# EasyEDA Pro project ProProject_AT32F403A拓展版_2024-07-07.epro

# Schematic Schematic1
Create Date: 2024-06-26; Page Name: P1; Project Name: AT32F403A拓展版; Schematic Name: Schematic1; Update Date: 2024-06-26; Company: 嘉立创EDA; Page Size: A4; Version: V1.0
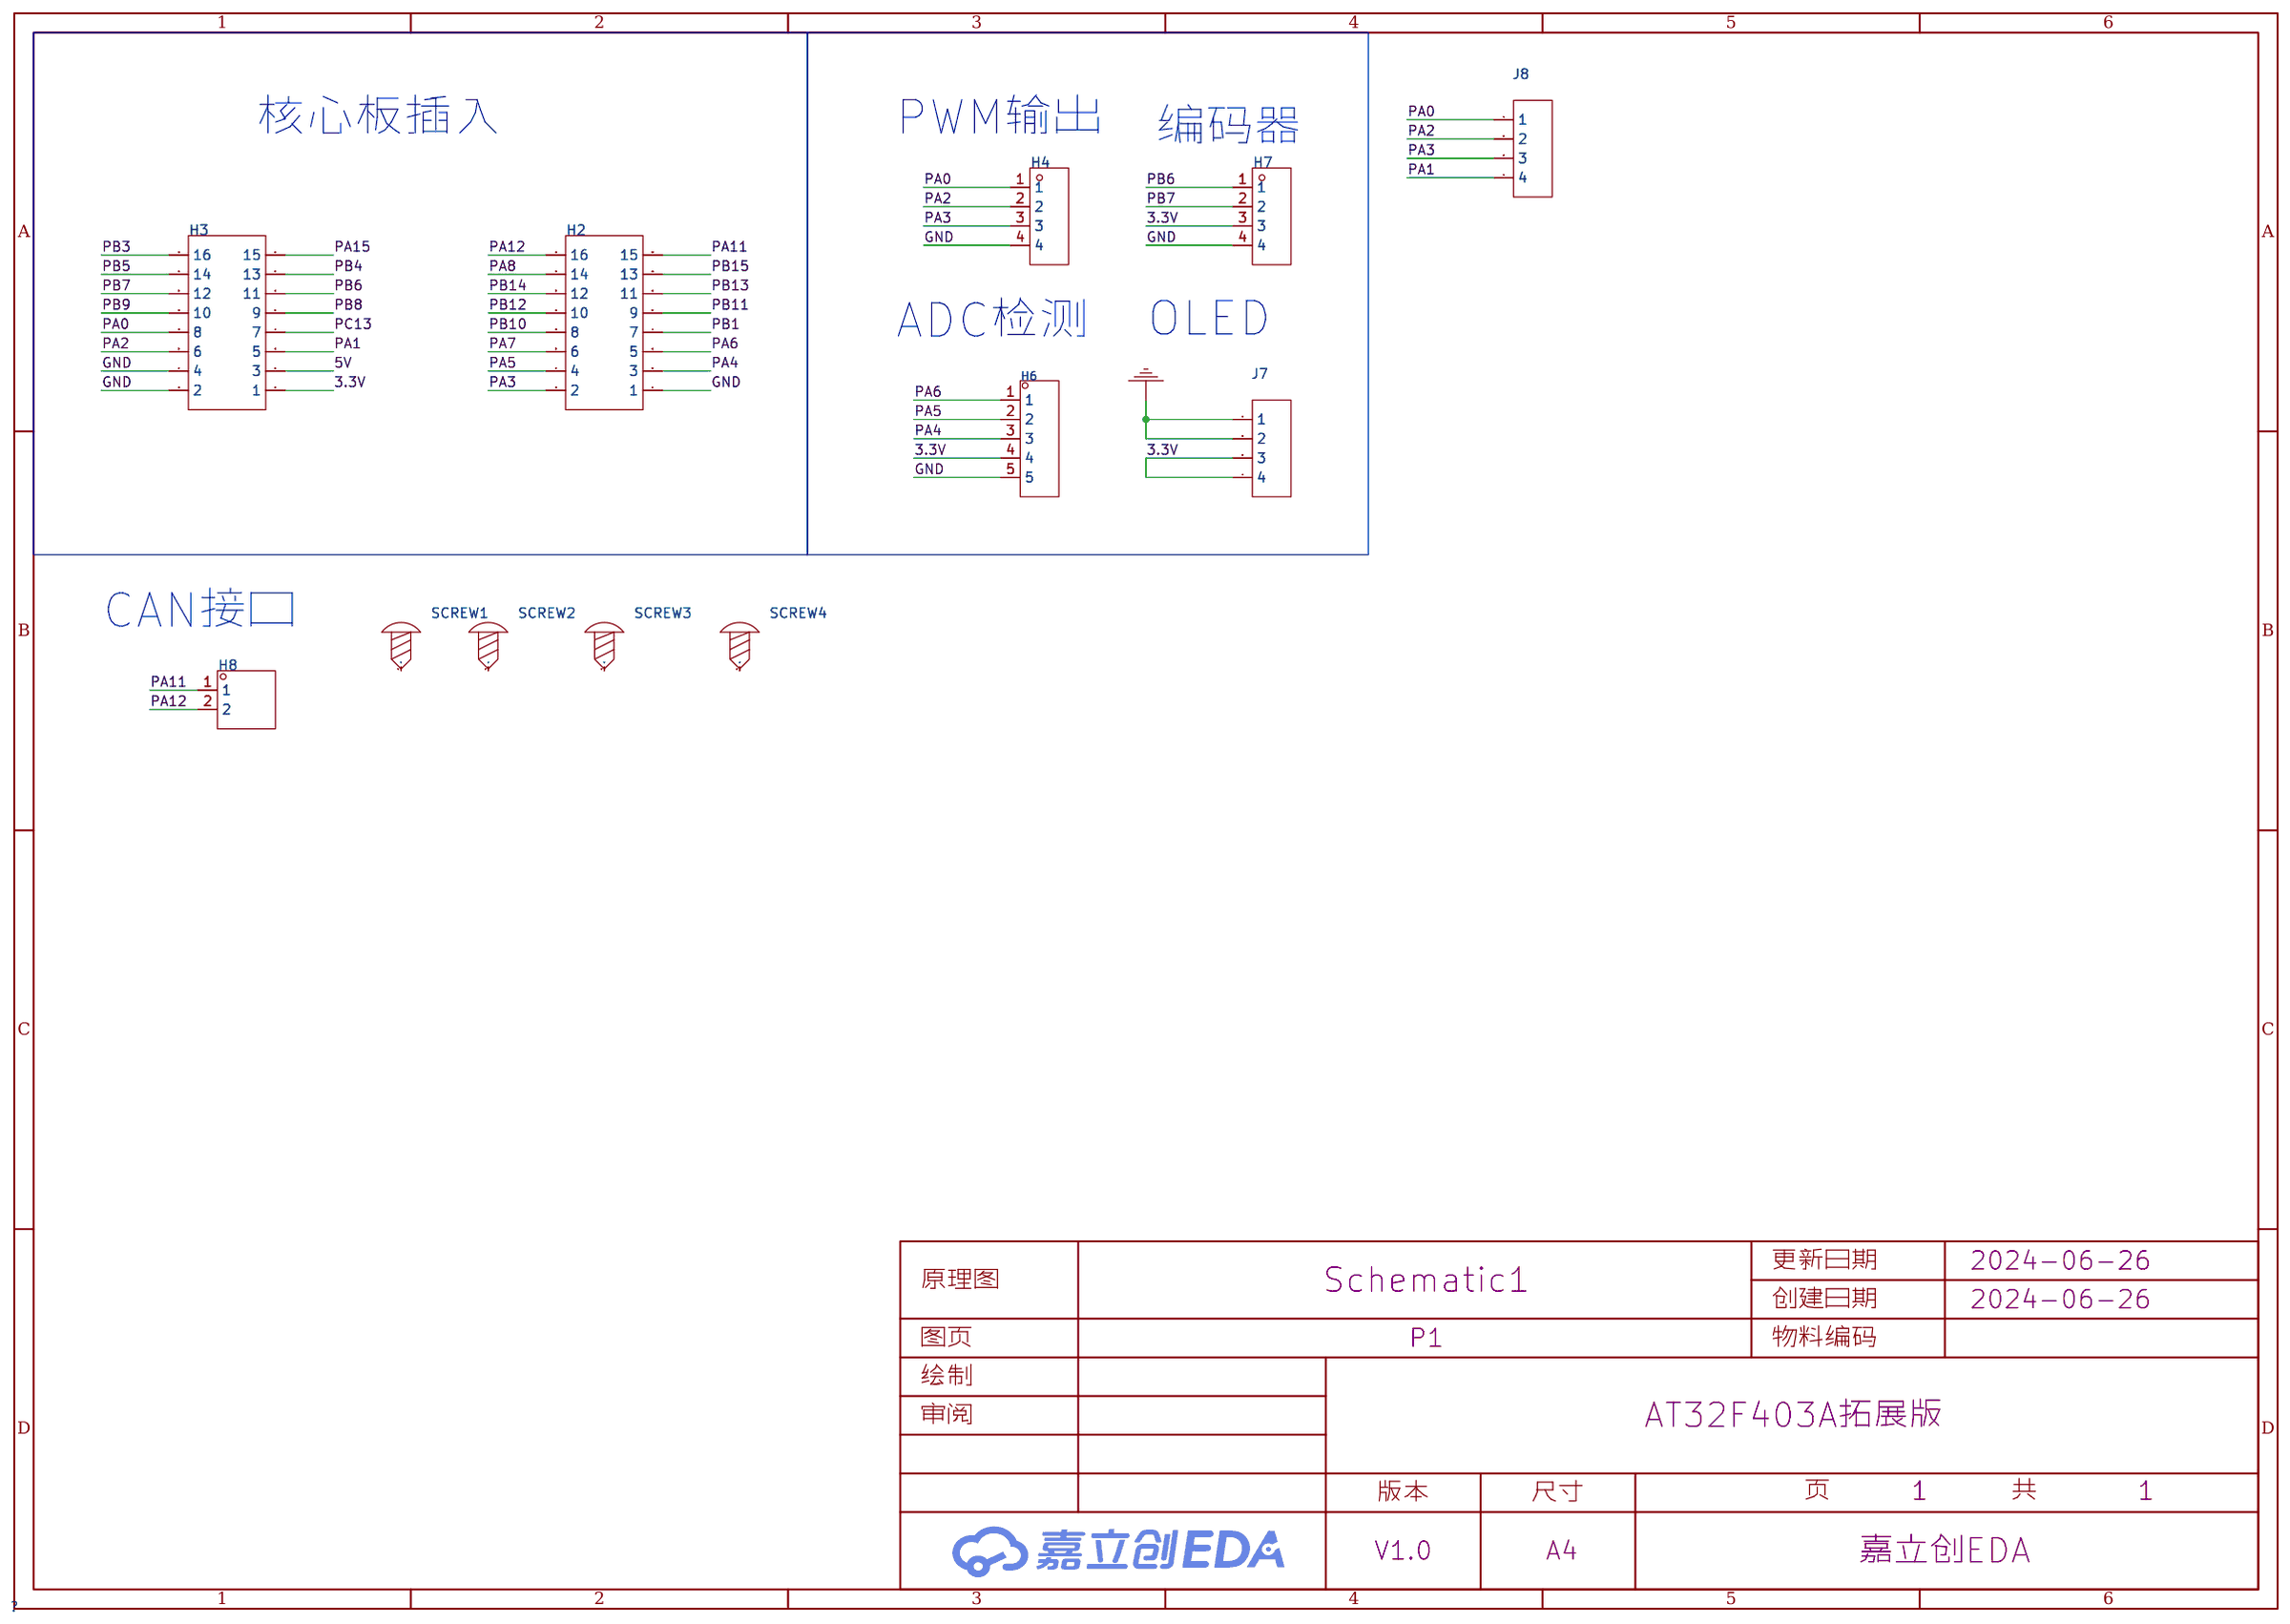
[diagram p0: schematic sheet]

## Parts
H2  -  [HDR-TH_16P-P2.54-V-M-R2-C8-S2.54]
H3  -  [HDR-TH_16P-P2.54-V-M-R2-C8-S2.54]
H4  -  [HDR-TH_4P-P2.54-V-M]
H6  -  [HDR-TH_5P-P2.54-V-M]
H7  -  [HDR-TH_4P-P2.54-V-M]
H8  -  [HDR-TH_2P-P2.54-V-M-1]
J7  HDR-M-2.54_1x4  [footprint_c5e7]
J8  HDR-M-2.54_1x4  [footprint_c5e7]
SCREW1  -  [M2螺丝]
SCREW2  -  [M2螺丝]
SCREW3  -  [M2螺丝]
SCREW4  -  [M2螺丝]

## Library data of the parts
H2 H3 = HDR-M_2.54_2x8: Supplier Part: C68234; Supplier Footprint: 插件,P=2.54mm
H4 H7 = HDR-M_2.54_1x4P: Supplier Part: C492403; Supplier Footprint: 插件
H6 = HDR-M_2.54_1x5P: Supplier Part: C358687; Supplier Footprint: 插件
H8 = HDR-M_2.54_1x2P: Supplier Part: C124375; Supplier Footprint: 插件
J7 J8 = HDR-M-2.54_1x4: Supplier Part: C124378; Supplier: LCSC
SCREW1-SCREW4 = M2螺丝: Supplier Footprint: 插件

## Nets
3.3V: H3.1 H6.4 H7.3 J7.3 J7.4
5V: H3.3
GND: H2.1 H3.2 H3.4 H4.4 H6.5 H7.4 J7.1 J7.2
PA0: H3.8 H4.1 J8.1
PA1: H3.5 J8.4
PA2: H3.6 H4.2 J8.2
PA3: H2.2 H4.3 J8.3
PA4: H2.3 H6.3
PA5: H2.4 H6.2
PA6: H2.5 H6.1
PA7: H2.6
PA8: H2.14
PA11: H2.15 H8.1
PA12: H2.16 H8.2
PA15: H3.15
PB1: H2.7
PB3: H3.16
PB4: H3.13
PB5: H3.14
PB6: H3.11 H7.1
PB7: H3.12 H7.2
PB8: H3.9
PB9: H3.10
PB10: H2.8
PB11: H2.9
PB12: H2.10
PB13: H2.11
PB14: H2.12
PB15: H2.13
PC13: H3.7

Not connected (* = marked no-connect by the designer): SCREW1 1; SCREW2 1; SCREW3 1; SCREW4 1

## Notes on the sheet
- 核心板插入
- PWM输出
- 编码器
- ADC检测
- OLED
- CAN接口

# Board PCB1
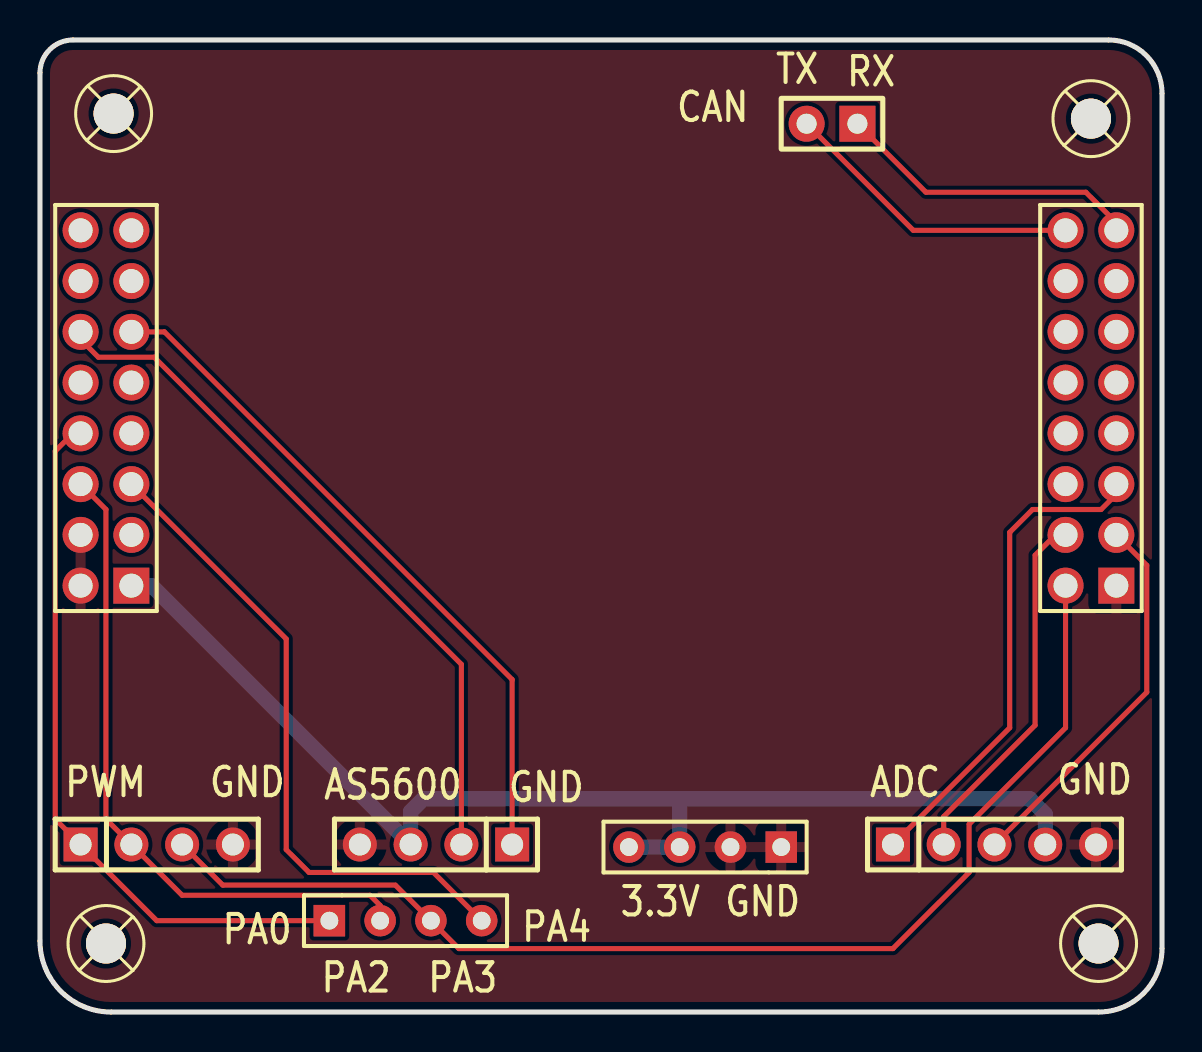
[diagram p1: board, top side]
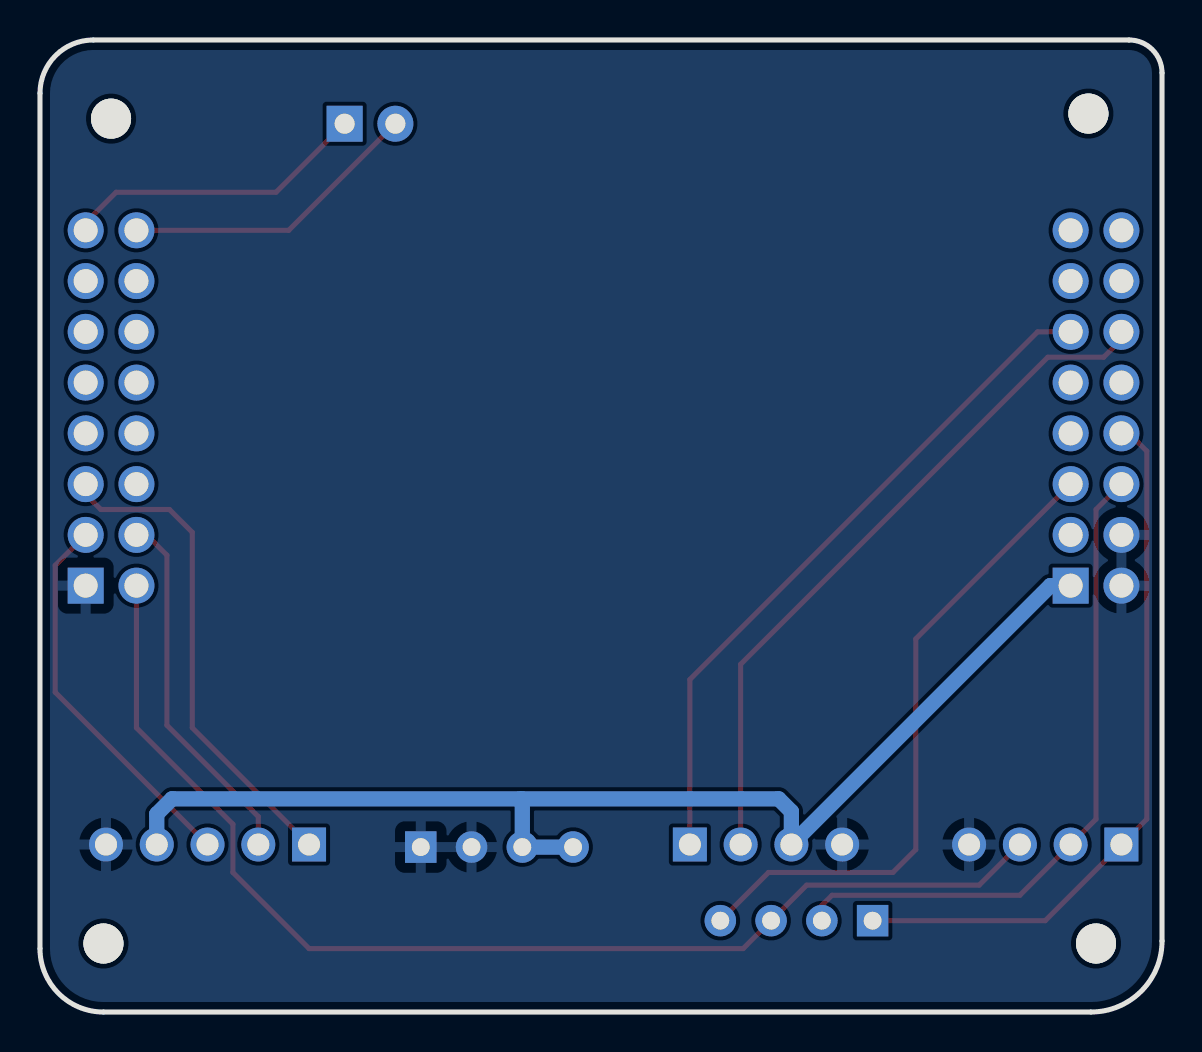
[diagram p2: board, bottom side, seen from below]

Outline 56.13 x 48.64 mm; copper layers: Top Layer, Bottom Layer. Coordinates in mm from the lower left corner of the outline.
Outline path: 0,46.99 arc(0.48,48.16) 1.65,48.64 53.47,48.64 arc(55.35,47.86) 56.13,45.97 56.13,3.17 arc(55.2,0.93) 52.96,0 3.56,0 arc(1.04,1.04) 0,3.56 0,46.99
Stack: Top Layer 0.035mm / Dielectric1 1.51mm FR4 er 4.5 / Bottom Layer 0.035mm

## Design rules (mm)
template: JLCPCB Capability(Two Layers Board)
spacing copperThickness1oz (default): track to track 0.102, other pairs 0.152 to 0.3
spacing copperThickness2oz: track to track 0.203, other pairs 0.152 to 0.3
track width copperThickness1oz (default): min 0.127, default 0.254, max 2.54
track width copperThickness2oz: min 0.203, default 0.254, max 2.54
differential pair differentialPair (default): width min 0.127, default 0.254, max 2.54; gap min 0.152, default 0.152
via viaSize (default): diameter min 0.5, default 0.61, max 10; hole min 0.3, default 0.305, max 6.3

## Placement (name value [footprint] x y rotation side)
H2  -  [HDR-TH_16P-P2.54-V-M-R2-C8-S2.54]  52.58 30.23 90 top
H3  -  [HDR-TH_16P-P2.54-V-M-R2-C8-S2.54]  3.3 30.23 90 top
H4  -  [HDR-TH_4P-P2.54-V-M]  5.84 8.38 0 top
H6  -  [HDR-TH_5P-P2.54-V-M]  47.75 8.38 0 top
H7  -  [HDR-TH_4P-P2.54-V-M]  19.81 8.38 180 top
H8  -  [HDR-TH_2P-P2.54-V-M-1]  39.62 44.45 180 top
J7  HDR-M-2.54_1x4  [footprint_c5e7]  33.27 8.25 180 top
J8  HDR-M-2.54_1x4  [footprint_c5e7]  18.29 4.57 0 top
SCREW1  -  [M2螺丝]  3.68 44.96 0 top
SCREW2  -  [M2螺丝]  52.58 44.7 0 top
SCREW3  -  [M2螺丝]  3.3 3.43 0 top
SCREW4  -  [M2螺丝]  52.96 3.43 0 top

## Footprints (pads in the part's own frame, mm; a bottom-side part is the same pattern mirrored in y, then rotated)
footprint_c5e7
  rect 1.575x1.575 hole 0.889: 1(-3.81,0)
  round 1.575 hole 0.889: 2(-1.27,0) 3(1.27,0) 4(3.81,0)
HDR-TH_2P-P2.54-V-M-1
  rect 1.8x1.8 hole 1: 1(-1.27,0)
  round 1.8 hole 1: 2(1.27,0)
HDR-TH_4P-P2.54-V-M
  rect 1.7x1.7 hole 1.1: 1(-3.81,0)
  round 1.7 hole 1.1: 2(-1.27,0) 3(1.27,0) 4(3.81,0)
HDR-TH_5P-P2.54-V-M
  rect 1.7x1.7 hole 1.1: 1(-5.08,0)
  round 1.7 hole 1.1: 2(-2.54,0) 3(0,0) 4(2.54,0) 5(5.08,0)
HDR-TH_16P-P2.54-V-M-R2-C8-S2.54
  rect 1.8x1.8 hole 1.2: 1(-8.89,-1.27)
  round 1.8 hole 1.2: 2(-8.89,1.27) 3(-6.35,-1.27) 4(-6.35,1.27) 5(-3.81,-1.27) 6(-3.81,1.27) 7(-1.27,-1.27) 8(-1.27,1.27) 9(1.27,-1.27) 10(1.27,1.27) 11(3.81,-1.27) 12(3.81,1.27) 13(6.35,-1.27) 14(6.35,1.27) 15(8.89,-1.27) 16(8.89,1.27)
M2螺丝
  round 2 hole 2: 1(0,0)

## Nets
As in the schematic.

Pads without a net: SCREW1 1; SCREW2 1; SCREW3 1; SCREW4 1

## Routing (per net, layer and track width the routed paths; a pad name or vN(x,y) marks a point on that pad's centre or on a via; arc(x,y) is an arc through that point)
3.3V: length 59.8
  Bottom Layer w0.762: 32.07,10.67 49.53,10.67 50.29,9.91 H6.4 ; 32.07,10.67 19.18,10.67 18.54,10.03 H7.3 5.59,21.34 H3.1 ; 32.07,10.67 32,10.61 32,8.25 J7.4
PA0: length 35.9
  Top Layer w0.254: J8.1 5.84,4.57 H4.1 0.76,9.65 0.76,28.07 1.65,28.96 H3.8
PA1: length 32.7
  Top Layer w0.254: J8.4 19.68,6.98 13.46,6.98 12.32,8.13 12.32,18.67 H3.5
PA2: length 33.2
  Top Layer w0.254: J8.2 17.02,5.33 16.51,5.84 7.11,5.84 4.82,8.13 ; H3.6 3.3,25.15 3.3,9.65 H4.2
PA3: length 59.1
  Top Layer w0.254: 7.36,8.13 9.14,6.35 17.78,6.35 J8.3 20.95,3.17 42.67,3.17 46.48,6.98 46.48,9.4 51.31,14.22 51.31,21.34
PA4: length 19.3
  Top Layer w0.254: H2.3 55.37,22.35 55.37,16 H6.3
PA5: length 18.3
  Top Layer w0.254: 51.31,23.88 50.8,23.88 49.78,22.86 49.78,14.35 45.21,9.78 H6.2
PA6: length 24.7
  Top Layer w0.254: H2.5 53.85,25.91 53.09,25.15 49.66,25.15 48.51,24 48.51,14.22 H6.1
PA11: length 15.4
  Top Layer w0.254: H8.1 44.32,41.02 52.32,41.02 53.85,39.5 H2.15
PA12: length 15.2
  Top Layer w0.254: H8.2 43.69,39.12 51.31,39.12
PB6: length 34.5
  Top Layer w0.254: H3.11 6.22,34.04 23.62,16.64 H7.1
PB7: length 35.2
  Top Layer w0.254: H3.12 2.03,33.66 2.92,32.77 5.71,32.77 21.08,17.4 H7.2

## Copper pours and planes (outline as drawn; the poured copper is in the pictures)
GND on Top Layer: -4.32,56.9 65.66,56.9 65.66,-8.64 -4.32,-8.64
GND on Bottom Layer: -2.16,53.85 60.07,53.85 60.07,-2.41 -2.16,-2.41

## Text on the board
Top Silkscreen Layer: PWM | GND | PA0 | PA2 | AS5600 | PA3 | PA4 | 3.3V | CAN | TX | RX | ADC
